# EAGLE design rgb-bar-graph-daughterboard (EAGLE 7.4.0)
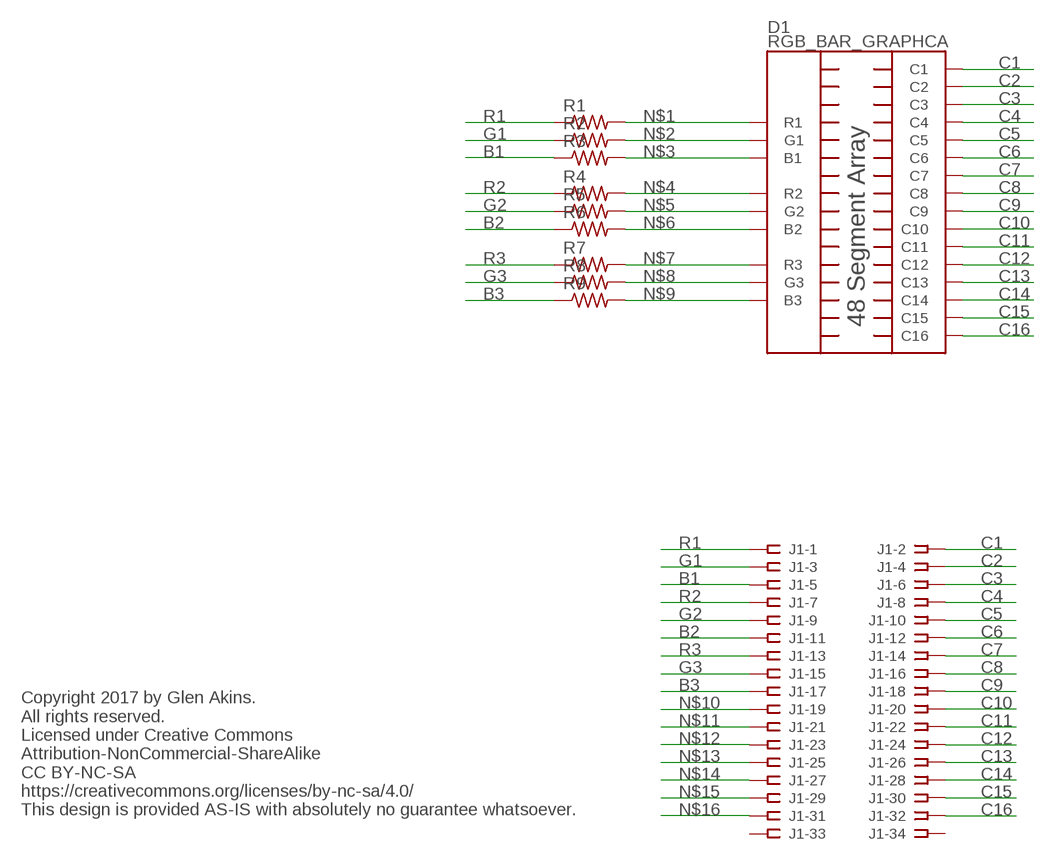
[diagram p0: schematic, sheet 1]

## Parts
D1  RGB_BAR_GRAPHCA  [RGB_BAR_GRAPH]
J1  RGB-BAR-GRAPH-2X17-MOD-PADS  [RGB-BAR-GRAPH-SMD-34-PIN]
R1  R-US_R1206  [R1206]
R2  R-US_R1206  [R1206]
R3  R-US_R1206  [R1206]
R4  R-US_R1206  [R1206]
R5  R-US_R1206  [R1206]
R6  R-US_R1206  [R1206]
R7  R-US_R1206  [R1206]
R8  R-US_R1206  [R1206]
R9  R-US_R1206  [R1206]

## Nets
B1: J1.5 R3.1
B2: J1.11 R6.1
B3: J1.17 R9.1
C1: D1.1(C1) J1.2
C2: D1.25(C2) J1.4
C3: D1.3(C3) J1.6
C4: D1.4(C4) J1.8
C5: D1.23(C5) J1.10
C6: D1.5(C6) J1.12
C7: D1.22(C7) J1.14
C8: D1.21(C8) J1.16
C9: D1.20(C9) J1.18
C10: D1.8(C10) J1.20
C11: D1.19(C11) J1.22
C12: D1.18(C12) J1.24
C13: D1.10(C13) J1.26
C14: D1.11(C14) J1.28
C15: D1.15(C15) J1.30
C16: D1.12(C16) J1.32
G1: J1.3 R2.1
G2: J1.9 R5.1
G3: J1.15 R8.1
N$1: D1.9(R1) R1.2
N$2: D1.7(G1) R2.2
N$3: D1.24(B1) R3.2
N$4: D1.17(R2) R4.2
N$5: D1.16(G2) R5.2
N$6: D1.6(B2) R6.2
N$7: D1.13(R3) R7.2
N$8: D1.2(G3) R8.2
N$9: D1.14(B3) R9.2
N$10: J1.19
N$11: J1.21
N$12: J1.23
N$13: J1.25
N$14: J1.27
N$15: J1.29
N$16: J1.31
R1: J1.1 R1.1
R2: J1.7 R4.1
R3: J1.13 R7.1
Unconnected: J1.33 J1.34

## Notes on the sheet
- Copyright 2017 by Glen Akins.
  All rights reserved.
  Licensed under Creative Commons
  Attribution-NonCommercial-ShareAlike
  CC BY-NC-SA
  https://creativecommons.org/licenses/by-nc-sa/4.0/
  This design is provided AS-IS with absolutely no guarantee whatsoever.

## Library data of the parts
D1 = SparkFun-LED:RGB_BAR_GRAPH: SparkFun 48 Segment RGB Bar Graph - Common Anode; PROD_ID: COM-13520
J1 = 0GlenConnectors:RGB-BAR-GRAPH-2X17-MOD-PADS
R1-R9 = rcl:R-US_: RESISTOR, American symbol

## Board
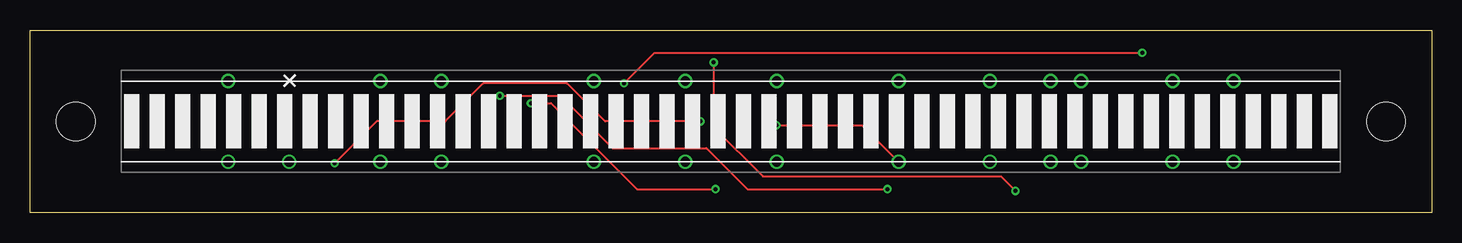
[diagram p1: board, top side]
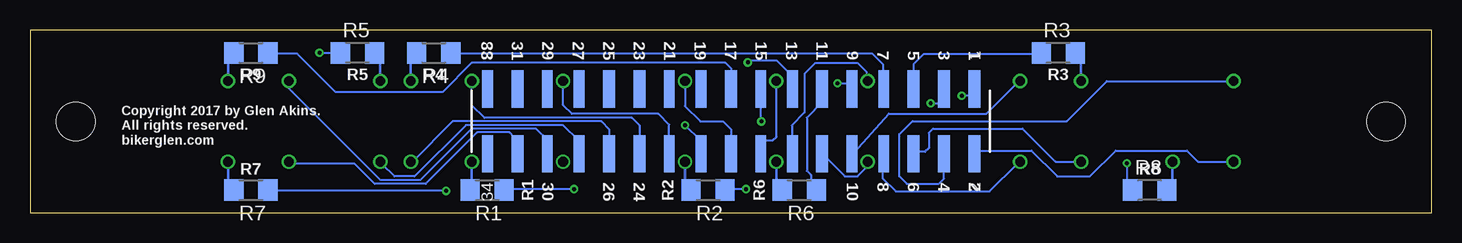
[diagram p2: board, bottom side, seen from below]

Size 116.84 x 15.24 mm. Coordinates in mm from the lower left corner, seen from the top.
Outline: 0,0 0,15.24 116.84,15.24 116.84,0 0,0
Copper layers (1*16): Top 0.0356mm / dielectric 1.5011mm / Bottom 0.0356mm
Design rules "oshpark-2layer": minimum track width 6mil, minimum drill 13mil, track to track 6mil, track to pad 6mil, pad to pad 6mil, via to via 6mil, smd to smd 6mil, copper to edge 15mil, drill to drill 6mil, minimum pad ring 7mil, minimum via ring 7mil, stop-mask expansion 2.5mil, vias tented up to drill 0mil, thermal gap 10mil
Holes 3.2 mm at 3.81,7.62 113.03,7.62

### Footprints (pad centres in the part's own frame; a part is rotated, then mirrored left to right if it is on the bottom)
RGB_BAR_GRAPH = drill 0.8: 1 3.36,-41.9; 2 3.36,-36.82; 3 3.36,-29.2; 4 3.36,-24.12; 5 3.36,-11.42; 6 3.36,-3.8; 7 3.36,3.82; 8 3.36,13.98; 9 3.36,21.6; 10 3.36,26.68; 11 3.36,29.22; 12 3.36,36.84; 13 3.36,41.92; 14 -3.36,41.92; 15 -3.36,36.84; 16 -3.36,29.22; 17 -3.36,26.68; 18 -3.36,21.6; 19 -3.36,13.98; 20 -3.36,3.82; 21 -3.36,-3.8; 22 -3.36,-11.42; 23 -3.36,-24.12; 24 -3.36,-29.2; 25 -3.36,-41.9
RGB-BAR-GRAPH-SMD-34-PIN = smd 3.1 x 1: 1 -2.7,20.32; 2 2.7,20.32; 3 -2.7,17.78; 4 2.7,17.78; 5 -2.7,15.24; 6 2.7,15.24; 11 -2.7,7.62; 12 2.7,7.62; 17 -2.7,0; 18 2.7,0; 23 -2.7,-7.62; 24 2.7,-7.62; 25 -2.7,-10.16; 26 2.7,-10.16; 31 -2.7,-17.78; 32 2.7,-17.78 | smd 3.1 x 0.9: 7 -2.7,12.75; 8 2.7,12.75; 9 -2.7,10.11; 10 2.7,10.11; 13 -2.7,5.13; 14 2.7,5.13; 15 -2.7,2.49; 16 2.7,2.49; 19 -2.7,-2.49; 20 2.7,-2.49; 21 -2.7,-5.13; 22 2.7,-5.13; 27 -2.7,-12.65; 28 2.7,-12.65; 29 -2.7,-15.29; 30 2.7,-15.29; 33 -2.7,-20.27; 34 2.7,-20.27
R1206 = smd 1.6 x 1.803: 1 -1.422,0; 2 1.422,0

### Placement (x,y rotation side)
D1  58.42,7.62 270 top
J1  58.42,7.62 270 bottom
R1  78.74,1.91 180 bottom
R2  60.33,1.91 180 bottom
R3  31.11,13.34 0 bottom
R4  83.19,13.34 180 bottom
R5  89.53,13.34 0 bottom
R6  52.7,1.91 180 bottom
R7  98.42,1.91 180 bottom
R8  23.5,1.91 0 bottom
R9  98.42,13.34 180 bottom

### Tracks (layer width: path | path; a pad name or v marks a point on that pad's centre or on a via)
B1
  Bottom 0.152: R3.1 32.61,13.26 42.3,13.26 43.18,12.38 J1.5
B2
  Bottom 0.152: R6.1 51.75,2.37 51.75,3.17 52.07,3.49 52.07,7.94 50.8,9.21 J1.11
B3
  Bottom 0.152: R9.1 96.93,13.26 94.55,13.26 91.35,10.06 82.46,10.06 80.01,12.51 58.86,12.51 58.42,12.06 J1.17
C1
  Bottom 0.152: D1.1 16.61,4.27 19.47,4.27 20.38,5.18 26.34,5.18 28.49,3.04 31.2,3.04 33.35,5.18 37.95,5.18 38.1,5.03 J1.2
C2
  Bottom 0.152: D1.25 16.61,10.97 27.09,10.97 30.42,7.64 43.27,7.64 44.36,6.55 44.36,3.04 43.74,2.41 41.08,2.41 40.64,2.86 J1.4
C3
  Bottom 0.152: D1.3 29.26,4.27 31.34,4.27 34.1,7.02 41.55,7.02 41.91,6.67 41.91,5.4 42.23,5.08 43.02,5.08 J1.6
C4
  Bottom 0.152: D1.4 34.44,4.12 34.52,4.12 36.84,1.79 44.65,1.79 45.72,2.86 45.72,4.87 J1.8
C5
  Bottom 0.152: D1.23 34.44,10.97 34.42,10.97 37.12,8.27 45.24,8.27 48.16,5.03 J1.10
C6
  Bottom 0.152: D1.5 47.09,4.12 47.09,3.81 47.85,3.05 48.92,3.05 50.75,4.88 J1.12
C7
  Bottom 0.152: D1.22 47.09,11.12 47.09,11.75 47.85,12.51 51.36,12.51 52.26,11.61 52.26,8.38 53.34,7.3 53.34,4.97 J1.14
C8
  Bottom 0.152: J1.16 55.93,5.67 55.56,6.03 54.93,6.03 54.61,6.35 D1.21
C9
  Bottom 0.152: D1.20 62.24,8.9 60.96,7.62 59.05,7.62 58.42,6.99 J1.18
C10  (via drill 0.33)
  Top 0.152: v62.23,7.3 69.36,7.3 D1.8
  Bottom 0.152: v62.23,7.3 60.96,6.03 60.96,4.97 J1.20
C11
  Bottom 0.152: D1.19 72.39,8.98 71.67,8.26 64.45,8.26 63.55,7.35 J1.22
C12
  Bottom 0.152: D1.18 80.01,8.98 78.96,7.92 66.66,7.92 66.04,7.3 J1.24
C13
  Bottom 0.152: D1.10 85.04,4.27 84.96,4.27 81.61,7.62 69.22,7.62 68.58,6.99 J1.26
C14
  Bottom 0.152: D1.11 87.63,4.12 87.53,4.12 86.45,3.04 84.78,3.04 80.5,7.32 72.4,7.32 71.12,6.03 71.12,4.97 J1.28
C15
  Bottom 0.152: D1.15 95.25,10.35 87.63,2.73 84.31,2.73 80.03,7.01 74.64,7.01 73.66,6.03 73.66,4.97 J1.30
C16
  Bottom 0.152: D1.12 95.25,4.12 89.79,4.12 88.1,2.43 83.84,2.43 79.57,6.71 76.87,6.71 76.52,6.35 76.52,5.24 J1.32
G1  (via drill 0.33)
  Top 0.152: v57.15,1.98 50.6,1.98 43.43,9.14 v41.76,9.14
  Bottom 0.152: v57.15,1.98 58.83,1.98 R2.1 | v41.76,9.14 40.89,9.14 40.64,8.89 J1.3
G2  (via drill 0.33)
  Top 0.152: v49.53,10.79 52.07,13.34 v92.71,13.34
  Bottom 0.152: v92.71,13.34 R5.1 | v49.53,10.79 48.78,10.79 J1.9
G3  (via drill 0.33)
  Top 0.152: v55.88,7.62 47.94,7.62 44.77,10.79 37.78,10.79 34.61,7.62 28.89,7.62 v25.4,4.13
  Bottom 0.152: J1.15 55.93,7.67 v55.88,7.62 | v25.4,4.13 25.4,2.39 R8.1
N$1
  Bottom 0.203: D1.9 80.02,2.05 R1.2
N$2
  Bottom 0.203: D1.7 62.24,2.4 R2.2
N$3
  Bottom 0.203: D1.24 29.22,12.86 R3.2
N$4
  Bottom 0.203: D1.17 85.1,12.84 R4.2
N$5
  Bottom 0.203: D1.16 87.64,12.86 R5.2
N$6
  Bottom 0.203: D1.6 54.62,2.4 R6.2
N$7
  Bottom 0.203: D1.13 100.34,2.4 R7.2
N$8
  Bottom 0.203: D1.2 21.6,2.38 R8.2
N$9
  Bottom 0.203: D1.14 100.34,12.84 R9.2
R1  (via drill 0.33)
  Top 0.152: v39.17,9.75 44.22,9.75 48.58,5.4 56.39,5.4 59.8,1.98 v71.48,1.98
  Bottom 0.152: v71.48,1.98 77.27,1.98 R1.1 | v39.17,9.75 38.56,9.75 38.1,10.21 J1.1
R2
  Bottom 0.152: R4.1 81.69,13.26 46.6,13.26 45.72,12.38 45.72,10.36 J1.7
R3  (via drill 0.33)
  Top 0.152: v57,12.54 57,7.14 61.09,3.05 80.92,3.05 v82.14,1.83
  Bottom 0.152: v82.14,1.83 96.93,1.83 R7.1 | 53.34,10.36 J1.13 53.66,10.69 53.66,11.75 54.61,12.7 56.83,12.7 v57,12.54

### Text on the board
_tsilk: +
_bsilk: 1 | 3 | 5 | 7 | 9 | 11 | 13 | 15 | 17 | 19 | 21 | 23 | 25 | 27 | 29 | 31 | 33 | R3 | R4 | R5 | R9 | Copyright 2017 by Glen Akins. / All rights reserved. / bikerglen.com | R8 | 2 | 4 | 6 | 8 | 10 | 24 | 26 | 30 | R7 | R6 | R2 | R1